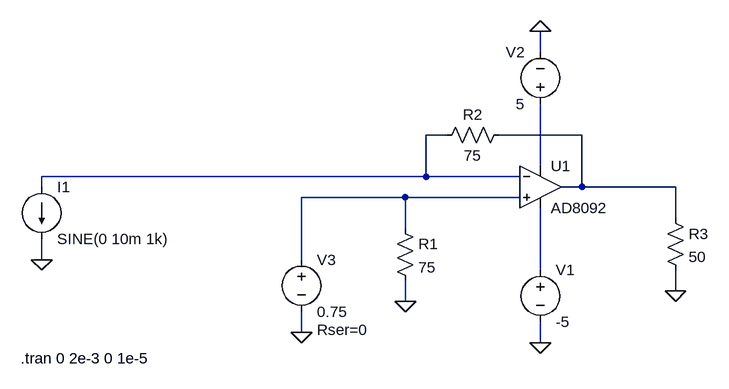
[diagram p0: schematic Current to Voltage OP AMP.asc]
Current to Voltage OP AMP.asc, the LTspice schematic file:
Version 4
SHEET 1 880 680
WIRE 144 -48 144 -80
WIRE 0 80 -32 80
WIRE 208 80 80 80
WIRE 144 128 144 32
WIRE -32 144 -32 80
WIRE -32 144 -624 144
WIRE 112 144 -32 144
WIRE -624 160 -624 144
WIRE 208 160 208 80
WIRE 208 160 176 160
WIRE 352 160 208 160
WIRE -64 176 -224 176
WIRE 112 176 -64 176
WIRE 352 208 352 160
WIRE -64 224 -64 176
WIRE -624 272 -624 240
WIRE -224 272 -224 176
WIRE 144 288 144 192
WIRE 352 320 352 288
WIRE -64 336 -64 304
WIRE -224 384 -224 352
WIRE 144 400 144 368
FLAG 144 400 0
FLAG 144 -80 0
FLAG 352 320 0
FLAG -64 336 0
FLAG -624 272 0
FLAG -224 384 0
SYMBOL OpAmps\\AD8092 144 96 R0
SYMATTR InstName U1
SYMBOL voltage 144 272 R0
WINDOW 123 0 0 Left 0
WINDOW 39 0 0 Left 0
SYMATTR InstName V1
SYMATTR Value -5
SYMBOL voltage 144 48 R180
WINDOW 0 24 96 Left 2
WINDOW 3 24 16 Left 2
WINDOW 123 0 0 Left 0
WINDOW 39 0 0 Left 0
SYMATTR InstName V2
SYMATTR Value 5
SYMBOL res -80 208 R0
SYMATTR InstName R1
SYMATTR Value 75
SYMBOL res 96 64 R90
WINDOW 0 0 56 VBottom 2
WINDOW 3 32 56 VTop 2
SYMATTR InstName R2
SYMATTR Value 75
SYMBOL res 336 192 R0
SYMATTR InstName R3
SYMATTR Value 50
SYMBOL current -624 160 R0
WINDOW 123 0 0 Left 0
WINDOW 39 0 0 Left 0
SYMATTR InstName I1
SYMATTR Value SINE(0 10m 1k)
SYMBOL voltage -224 256 R0
WINDOW 123 0 0 Left 0
WINDOW 39 24 124 Left 2
SYMATTR SpiceLine Rser=0
SYMATTR InstName V3
SYMATTR Value 0.75
TEXT -656 424 Left 2 !.tran 0 2e-3 0 1e-5

The netlist it stands for:
* Current to Voltage OP AMP.asc
XU1 N004 N001 N003 N005 N002 AD8092  ; pins In+ In- V+ V- OUT
V1 N005 0 -5
V2 N003 0 5
R1 N004 0 75
R2 N002 N001 75
R3 N002 0 50
I1 N001 0 SINE(0 10m 1k)
V3 N004 0 0.75 Rser=0
.tran 0 2e-3 0 1e-5
.backanno
.end